# EAGLE design board (EAGLE 9.6.0)
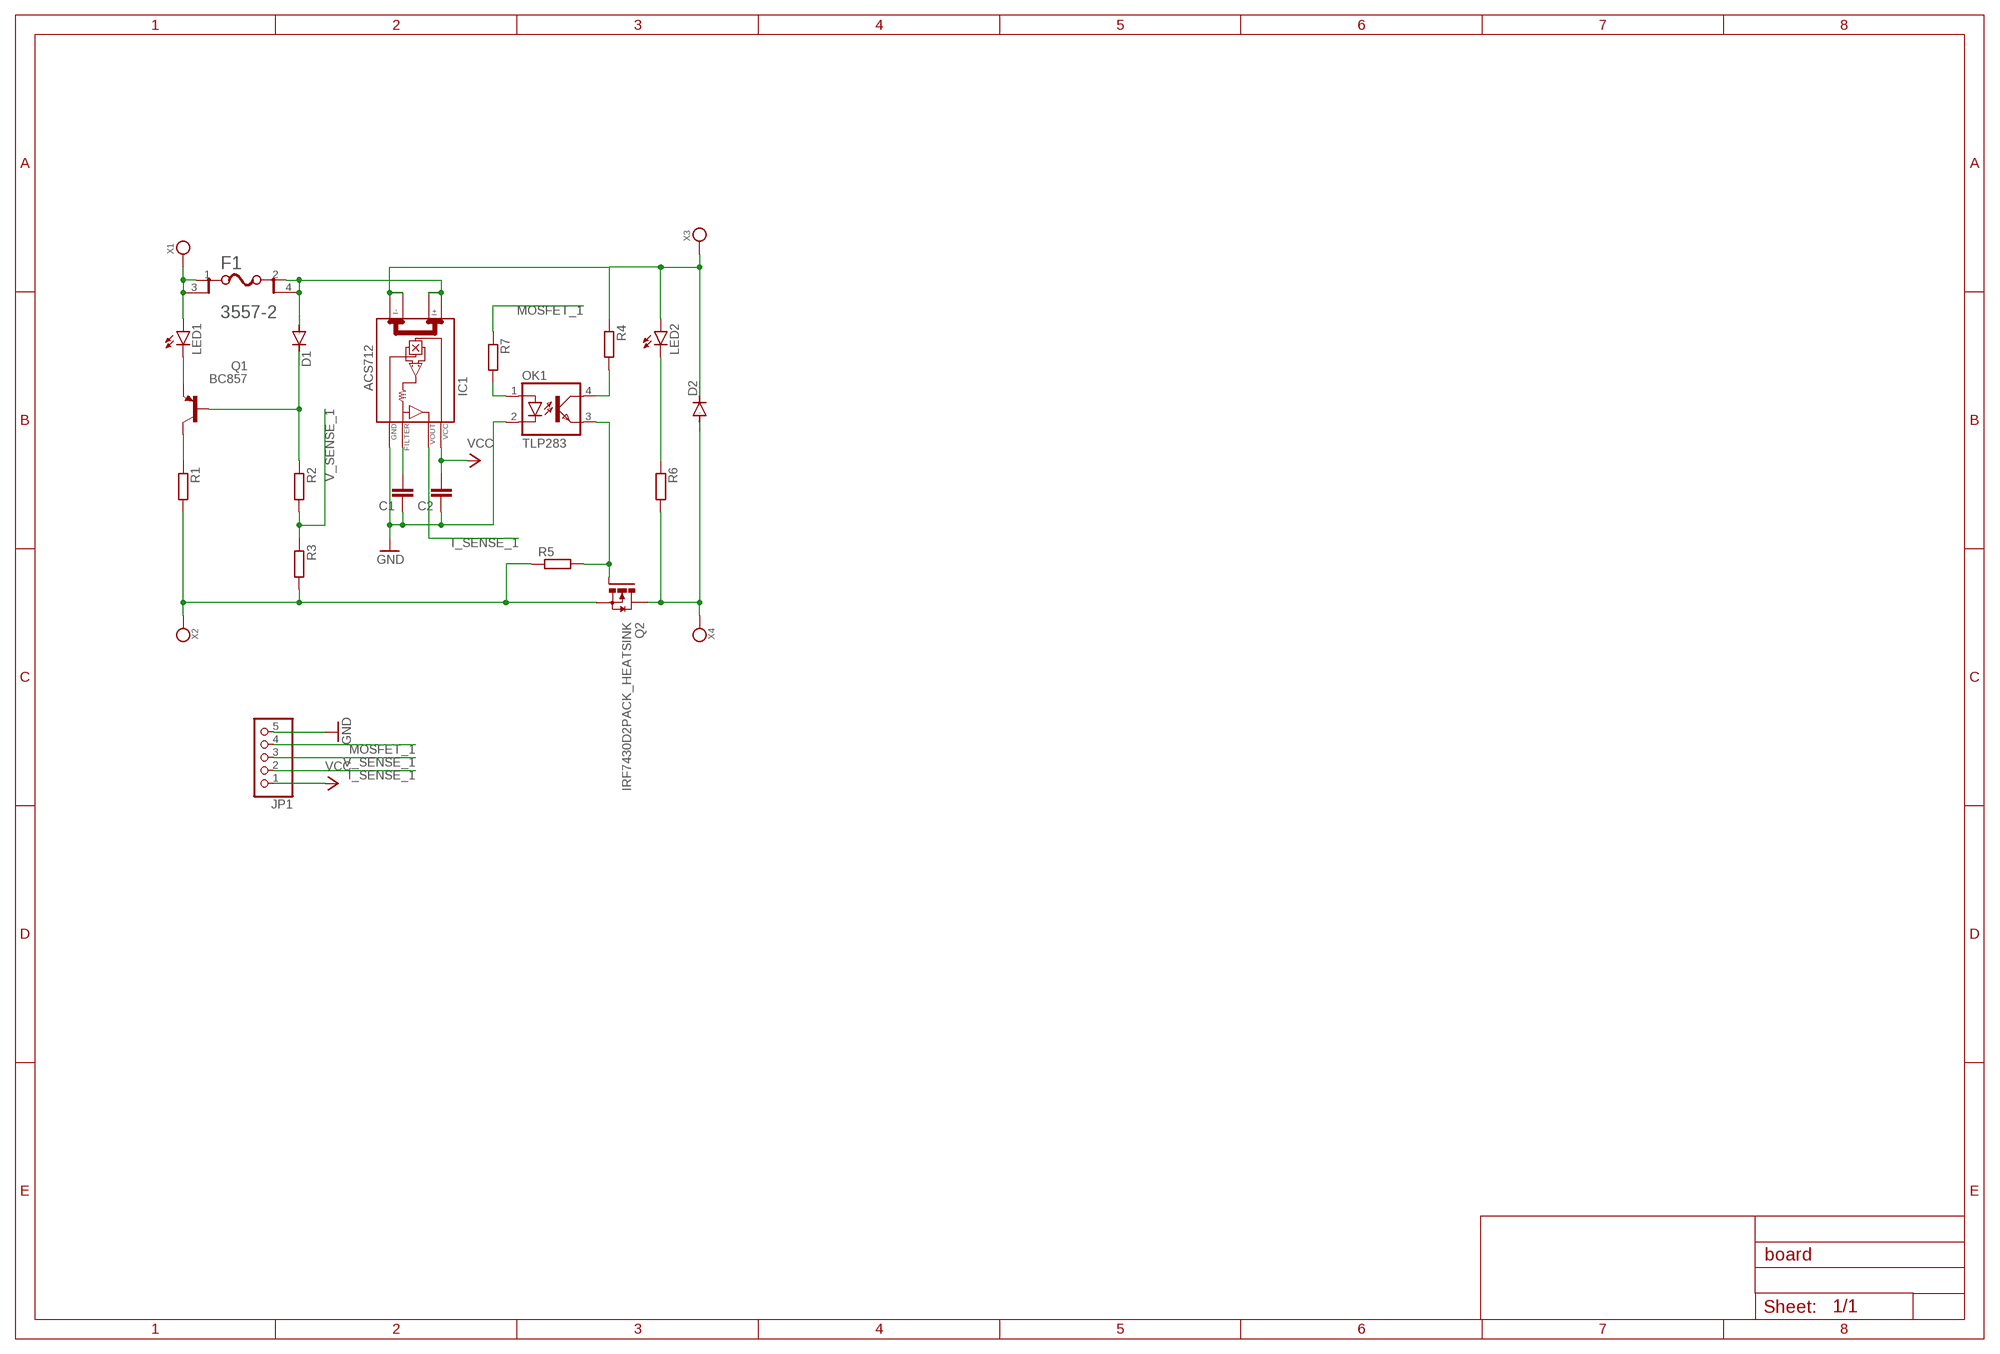
[diagram p0: schematic, sheet 1]

## Parts
C1  C-EUC0805  [C0805]
C2  C-EUC0805  [C0805]
D1  DIODE-SOD123  [DIODE_SOD123]
D2  DIODE-DO214AC  [DO214AC]
F1  KEYSTONE_3557-2KEYSTONE_3557-2_0_0  [KEYSTONE_3557-2_0]
IC1  ACS712  [SO08]
JP1  PINHD-1X5  [1X05]
LED1  LEDSMT1206  [1206]
LED2  LEDSMT1206  [1206]
OK1  TLP283  [MINI-FLAT-4]
Q1  BC857  BC857ASMD  [SOT23-BEC]
Q2  IRF7430D2PACK_HEATSINK  [D2PACK_HEATSINK]
R1  R-EU_R0805  [R0805]
R2  R-EU_R0805  [R0805]
R3  R-EU_R0805  [R0805]
R4  R-EU_R0805  [R0805]
R5  R-EU_R0805  [R0805]
R6  R-EU_R0805  [R0805]
R7  R-EU_R0805  [R0805]
X1  7800  [7800]
X2  7800  [7800]
X3  7800  [7800]
X4  7800  [7800]

## Nets
GND: C1.1 C2.1 IC1.5(GND) JP1.5 OK1.2(C)
I_SENSE_1: IC1.7(VOUT) JP1.2
MOSFET_1: JP1.4 R7.1
N$1: F1.1 F1.3 LED1.A X1.1(PIN) X1.2(PIN) X1.3(PIN) X1.4(PIN) X1.5(PIN) X1.6(PIN)
N$2: LED1.C Q1.E
N$3: Q1.C R1.1
N$4: Q2.3(S) R1.2 R3.2 R5.1 X2.1(PIN) X2.2(PIN) X2.3(PIN) X2.4(PIN) X2.5(PIN) X2.6(PIN)
N$5: D2.C IC1.3(I-_0) IC1.4(I-_1) LED2.A R4.1 X3.1(PIN) X3.2(PIN) X3.3(PIN) X3.4(PIN) X3.5(PIN) X3.6(PIN)
N$6: LED2.C R6.1
N$7: D1.A F1.2 F1.4 IC1.1(I+_0) IC1.2(I+_1)
N$8: D1.C Q1.B R2.1
N$9: C1.2 IC1.6(FILTER)
N$10: OK1.4(COL) R4.2
N$11: OK1.1(A) R7.2
N$12: OK1.3(EMIT) Q2.1(G) R5.2
N$13: D2.A Q2.2(D) Q2.4(D) Q2.5(D) R6.2 X4.1(PIN) X4.2(PIN) X4.3(PIN) X4.4(PIN) X4.5(PIN) X4.6(PIN)
V_SENSE_1: JP1.3 R2.2 R3.1
VCC: C2.2 IC1.8(VCC) JP1.1

## Library data of the parts
C1 C2 = rcl:C-EU: CAPACITOR, European symbol; SPICEPREFIX: C
D1 = Override_Parts:DIODE-: DIODE
D2 = diode:DIODE-: DIODE
F1 = Keystone - 3557:KEYSTONE_3557-2: THM 2 in 1 Auto Blade Holder; CENTROID_NOT_SPECIFIED: No; DATASHEET: http://www.keyelco.com/product-pdf.cfm?p=296; DIGIKEY_DESCRIPTION: Fuse Block 30A 500V 1 Circuit Blade PCB; DIGIKEY_PART_NUMBER: 36-3557-2-ND; LEAD_FREE: yes; MF: Keystone; MOUSER_PART_NUMBER: 534-3557-2; MPN: 3557-2; PACKAGE: PTH_FUSE_19MM81_6MM73; PREFIX: F; ROHS: yes; TEMPERATURE_RANGE_HIGH: +145°C; TEMPERATURE_RANGE_LOW: -50°C
IC1 = ACS712:ACS712
JP1 = pinhead:PINHD-1X5: PIN HEADER
LED1 LED2 = led:LED: LED OSRAM: - CHIPLED LG R971, LG N971, LY N971, LG Q971, LY Q971, LO R971, LY R971 LH N974, LH R974 LS Q976, LO Q976, LY Q976 LO Q996 - Hyper CHIPLED LW Q18S LB Q993, LB Q99A, LB R99A - SideLED LS A670, LO A670, LY A670, LG A670, LP A670 LB A673, LV A673, LT A673, LW A673 LH A674 LY A675 LS A676, LA A676, LO A676, LY A676, LW A676 LS A679, LY A679, LG A679 - Hyper Micro SIDELED® LS Y876, LA Y876, LO Y876, LY Y876 LT Y87S - SmartLED LW L88C, LW L88S LB L89C, LB L89S, LG L890 LS L89K, LO L89K, LY L89K LS L896, LA L896, LO L896, LY L896 - TOPLED LS T670, LO T670, LY T670, LG T670, LP T670 LSG T670, LSP T670, LSY T670, LOP T670, LYG T670 LG T671, LOG T671, LSG T671 LB T673, LV T673, LT T673, LW T673 LH T674 LS T676, LA T676, LO T676, LY T676, LB T676, LH T676, LSB T676, LW T676 LB T67C, LV T67C, LT T67C, LS T67K, LO T67K, LY T67K, LW E67C LS E67B, LA E67B, LO E67B, LY E67B, LB E67C, LV E67C, LT E67C LW T67C LS T679, LY T679, LG T679 LS T770, LO T770, LY T770, LG T770, LP T770 LB T773, LV T773, LT T773, LW T773 LH T774 LS E675, LA E675, LY E675, LS T675 LS T776, LA T776, LO T776, LY T776, LB T776 LHGB T686 LT T68C, LB T68C - Hyper Mini TOPLED® LB M676 - Mini TOPLED Santana® LG M470 LS M47K, LO M47K, LY M47K Source: http://www.osram.convergy.de LUXEON: - LUMILED® LXK2-PW12-R00, LXK2-PW12-S00, LXK2-PW14-U00, LXK2-PW14-V00 LXK2-PM12-R00, LXK2-PM12-S00, LXK2-PM14-U00 LXK2-PE12-Q00, LXK2-PE12-R00, LXK2-PE12-S00, LXK2-PE14-T00, LXK2-PE14-U00 LXK2-PB12-K00, LXK2-PB12-L00, LXK2-PB12-M00, LXK2-PB14-N00, LXK2-PB14-P00, LXK2-PB14-Q00 LXK2-PR12-L00, LXK2-PR12-M00, LXK2-PR14-Q00, LXK2-PR14-R00 LXK2-PD12-Q00, LXK2-PD12-R00, LXK2-PD12-S00 LXK2-PH12-R00, LXK2-PH12-S00 LXK2-PL12-P00, LXK2-PL12-Q00, LXK2-PL12-R00 Source: www.luxeon.com KINGBRIGHT: KA-3528ASYC Source: www.kingbright.com
OK1 = Override_Parts:TLP283: TOSHIBA PHOTOCOUPLER GaAs IRED & PHOTO-TRANSISTOR Source: http://www.semicon.toshiba.co.jp/td/en/Opto/Photocoupler/en_20050928_TLP283_datasheet.pdf; OC_FARNELL: unknown; OC_NEWARK: unknown
Q1 = transistor-pnp:BC857*: PNP Transistror
Q2 = Override_Parts:IRF7430: SMPS MOSFET HEXFET® Power MOSFET Source: http://www.irf.com/product-info/datasheets/data/irf3704.pdf
R1-R7 = rcl:R-EU_: RESISTOR, European symbol; SPICEPREFIX: R
X1-X4 = Keystone - 7800:7800

## Board
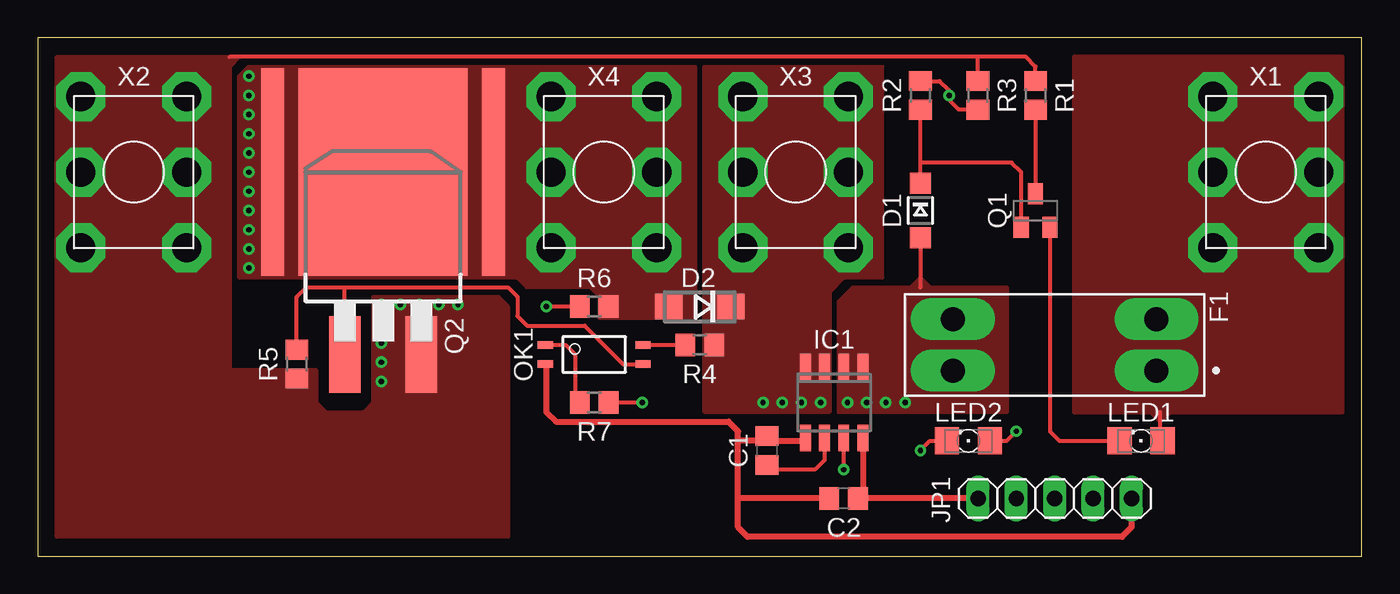
[diagram p1: board, top side]
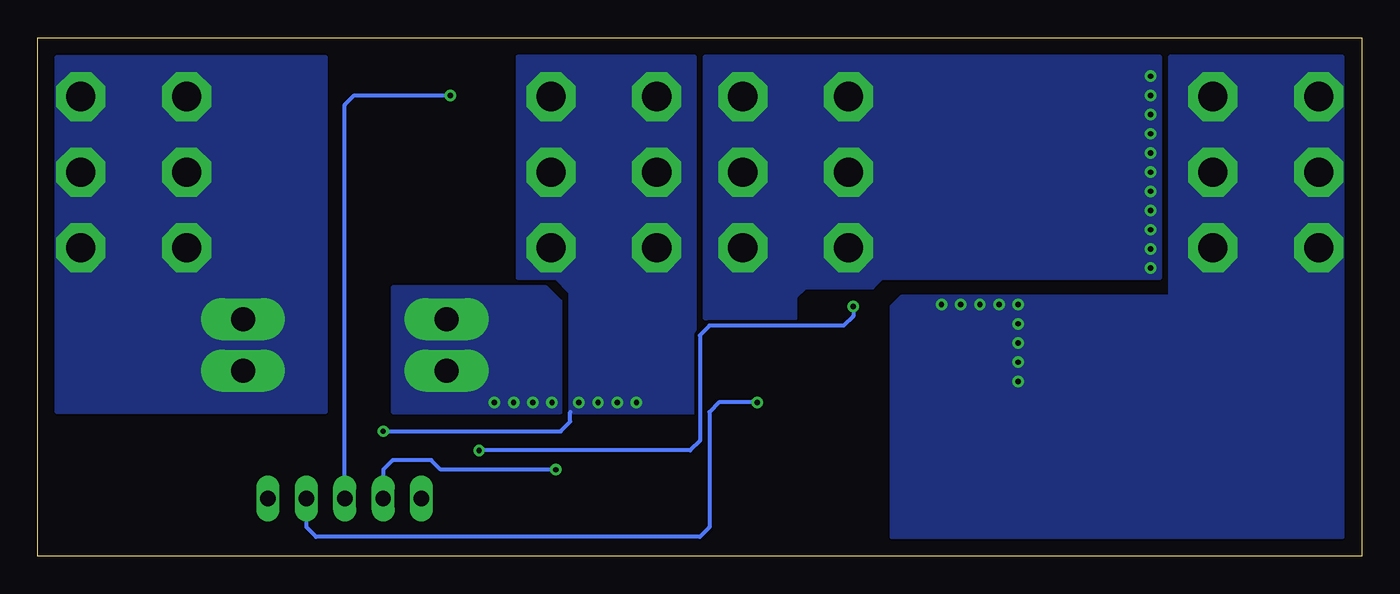
[diagram p2: board, bottom side, seen from below]

Size 87.63 x 34.29 mm. Coordinates in mm from the lower left corner, seen from the top.
Outline: 0,0 87.63,0 87.63,34.29 0,34.29 0,0
Copper layers (1*16): Top 0.035mm / dielectric 1.5mm / Bottom 0.035mm
Design rules "default *": minimum track width 8mil, minimum drill 0.3mm, track to track 8mil, track to pad 8mil, pad to pad 8mil, via to via 8mil, smd to smd 8mil, copper to edge 40mil, drill to drill 12mil, minimum pad ring 10mil, minimum via ring 8mil, stop-mask expansion 4mil, vias tented up to drill 16mil, thermal gap 10mil

### Footprints (pad centres in the part's own frame; a part is rotated, then mirrored left to right if it is on the bottom)
C0805 = smd 1.3 x 1.5: 1 -0.95,0; 2 0.95,0
DIODE_SOD123 = smd 1.4 x 1.4: A 1.805,0; C -1.805,0
DO214AC = smd 1.8 x 1.7: A 2.05,0; C -2.05,0
KEYSTONE_3557-2_0 = drill 1.6 pad 2.794 long: 1 -6.735,1.7; 2 6.735,1.7; 3 -6.735,-1.7; 4 6.735,-1.7
SO08 = smd 0.72 x 1.78: 1 -1.905,-2.35; 2 -0.635,-2.35; 3 0.635,-2.35; 4 1.905,-2.35; 5 1.905,2.35; 6 0.635,2.35; 7 -0.635,2.35; 8 -1.905,2.35
1X05 = drill 1.016 long: 1 -5.08,0; 2 -2.54,0; 3 0,0; 4 2.54,0; 5 5.08,0
1206 = smd 1.6 x 1.803: A -1.422,0; C 1.422,0
MINI-FLAT-4 = smd 1 x 0.5: 1 -3.24,0.635; 2 -3.24,-0.635; 3 3.24,-0.635; 4 3.24,0.635
SOT23-BEC = smd 1 x 1.4: B -0.95,-1.1; C 0,1.1; E 0.95,-1.1
D2PACK_HEATSINK = smd 2.083 x 5.08: 1 -2.54,-7.62; 3 2.54,-7.62 | smd 11.176 x 13.716: 2 0,4.445 | smd 1.524 x 13.716: 4 7.315,4.445; 5 -7.315,4.445
R0805 = smd 1.3 x 1.5: 1 -0.95,0; 2 0.95,0
7800 = drill 1.93 pad 3.25 octagon: 1 -3.5,5; 2 -3.5,0; 3 -3.5,-5; 4 3.5,-5; 5 3.5,0; 6 3.5,5

### Placement (x,y rotation side)
C1  48.26,6.99 270 top
C2  53.34,3.81 0 top
D1  58.42,22.86 270 top
D2  43.81,16.51 180 top
F1  67.31,13.97 180 top
IC1  52.7,10.16 180 top
JP1  67.31,3.81 0 top
LED1  73.03,7.62 180 top
LED2  61.59,7.62 180 top
OK1  36.83,13.34 0 top
Q1  66.04,22.86 0 top
Q2  22.86,20.95 0 top
R1  66.04,30.48 90 top
R2  58.42,30.48 90 top
R3  62.23,30.48 90 top
R4  43.81,13.97 180 top
R5  17.14,12.7 90 top
R6  36.83,16.51 0 top
R7  36.83,10.16 180 top
X1  81.28,25.4 0 top
X2  6.35,25.4 0 top
X3  50.16,25.4 0 top
X4  37.47,25.4 0 top

### Tracks (layer width: path | path; a pad name or v marks a point on that pad's centre or on a via)
GND
  Top 0.406: IC1.5 50.61,7.62 48.58,7.62 C1.1 47.95,7.62 46.35,7.62 | C2.1 46.35,3.81 | 46.35,3.81 46.35,7.62 | 46.35,7.62 46.35,8.26 45.72,8.89 34.29,8.89 33.66,9.53 33.66,12.63 OK1.2 | JP1.5 72.39,1.91 71.75,1.27 46.99,1.27 46.35,1.91 46.35,3.81
I_SENSE_1  (via drill 0.35)
  Top 0.254: IC1.7 v53.34,5.71
  Bottom 0.254: v53.34,5.71 60.96,5.71 61.59,6.35 64.14,6.35 64.77,5.71 JP1.2
MOSFET_1  (via drill 0.35)
  Top 0.254: R7.1 v40.01,10.16
  Bottom 0.254: v40.01,10.16 42.55,10.16 43.18,9.53 43.18,1.91 43.81,1.27 69.22,1.27 69.85,1.91 JP1.4
N$1
  Top 0.254: LED1.A 74.3,7.14 74.3,9.53
  pour Top (isolate 0.254, no thermals): 86.36,33.02 68.58,33.02 68.58,9.53 73.66,9.53 74.3,8.89 74.93,9.53 86.36,9.53
  pour Bottom (isolate 0.254, no thermals): 86.36,33.02 68.58,33.02 68.58,9.53 86.36,9.53
N$2
  Top 0.254: Q1.E 66.99,8.26 67.62,7.62 LED1.C
N$3
  Top 0.254: R1.1 Q1.C
N$4  (via drill 0.35)
  Top 0.254: R1.2 66.04,32.38 65.41,33.02 62.23,33.02 | 62.23,33.02 12.7,33.02 | R3.2 62.23,33.02
  other vias: 22.73,11.56 22.73,12.83 22.73,14.1 22.73,15.37 22.73,16.64 24,16.64 25.27,16.64 26.54,16.64 27.81,16.64
  pour Top (isolate 0.254, no thermals): 1.27,33.02 13.34,33.02 12.7,32.38 12.7,12.32 18.41,12.32 18.41,10.16 19.05,9.53 21.59,9.53 22.23,10.16 22.23,17.14 30.48,17.14 31.11,16.51 31.11,1.27 1.27,1.27
  pour Bottom (isolate 0.254, no thermals): 1.27,33.02 12.7,33.02 12.7,17.14 30.48,17.14 31.11,16.51 31.11,1.27 1.27,1.27
N$5  (via drill 0.35)
  Top 0.254: LED2.A 64.14,7.62 v64.77,8.26
  Bottom 0.254: v64.77,8.26 53.02,8.26 52.39,8.89 52.39,9.53
  other vias: 49.28,10.16 50.55,10.16 51.82,10.16 48.01,10.16
  pour Top (isolate 0.254, no thermals): 44.13,32.38 55.88,32.38 55.88,18.41 53.34,18.41 52.39,17.46 52.39,9.53 44.13,9.53
  pour Bottom (isolate 0.254, no thermals): 44.13,33.02 55.88,33.02 55.88,18.41 53.34,18.41 52.39,17.46 52.39,9.53 44.13,9.53
N$6  (via drill 0.35)
  Top 0.254: R6.1 v33.66,16.51 | v58.42,6.99 59.05,7.62 LED2.C
  Bottom 0.254: v33.66,16.51 33.66,15.88 34.29,15.24 43.18,15.24 43.81,14.61 43.81,7.62 44.45,6.99 v58.42,6.99
N$7  (via drill 0.35)
  Top 0.254: D1.A 58.42,17.78
  other vias: 53.59,10.16 54.86,10.16 56.13,10.16 57.4,10.16
  pour Top (isolate 0.254, no thermals): 64.14,17.78 64.14,9.53 53.02,9.53 53.02,16.83 53.98,17.78 57.78,17.78 58.42,18.41 59.05,17.78
  pour Bottom (isolate 0.254, no thermals): 64.14,17.78 64.14,9.53 53.02,9.53 53.02,16.83 53.98,17.78
N$8
  Top 0.254: D1.C 58.42,26.04 | 58.42,26.04 R2.1 | Q1.B 65.09,25.4 64.45,26.04 58.42,26.04
N$9
  Top 0.254: IC1.6 52.07,6.35 51.44,5.71 48.58,5.71 C1.2
N$10
  Top 0.254: OK1.4 R4.2
N$11
  Top 0.254: OK1.1 34.92,13.97 35.56,13.34 35.56,10.48 R7.2
N$12
  Top 0.254: 20.32,17.78 17.78,17.78 17.14,17.14 R5.2 | 20.32,17.78 31.11,17.78 31.75,17.14 31.75,15.88 32.38,15.24 36.2,15.24 38.73,12.7 OK1.3 | Q2.1 20.32,17.78
N$13  (via drill 0.35)
  other vias: 13.97,19.05 13.97,20.32 13.97,21.59 13.97,22.86 13.97,24.13 13.97,25.4 13.97,26.67 13.97,27.94 13.97,29.21 13.97,30.48 13.97,31.75
  pour Top (isolate 0.254, no thermals): 13.97,32.38 43.5,32.38 43.5,15.75 37.21,15.75 37.21,17.14 36.58,17.78 32.38,17.78 31.75,18.41 13.34,18.41 13.34,31.75
  pour Bottom (isolate 0.254, no thermals): 13.34,33.02 43.5,33.02 43.5,15.75 37.47,15.75 37.47,17.14 36.83,17.78 32.38,17.78 31.75,18.41 13.34,18.41
V_SENSE_1  (via drill 0.35)
  Top 0.254: R2.2 59.69,31.43 60.33,30.8 v60.33,30.48 60.33,30.16 60.96,29.53 R3.1
  Bottom 0.254: JP1.3 67.31,29.84 66.67,30.48 v60.33,30.48
VCC
  Top 0.406: IC1.8 54.61,4.13 54.45,3.97 | 54.45,3.97 C2.2 | JP1.1 54.61,3.81 54.45,3.97